# Altium project AioJig.PrjPcb
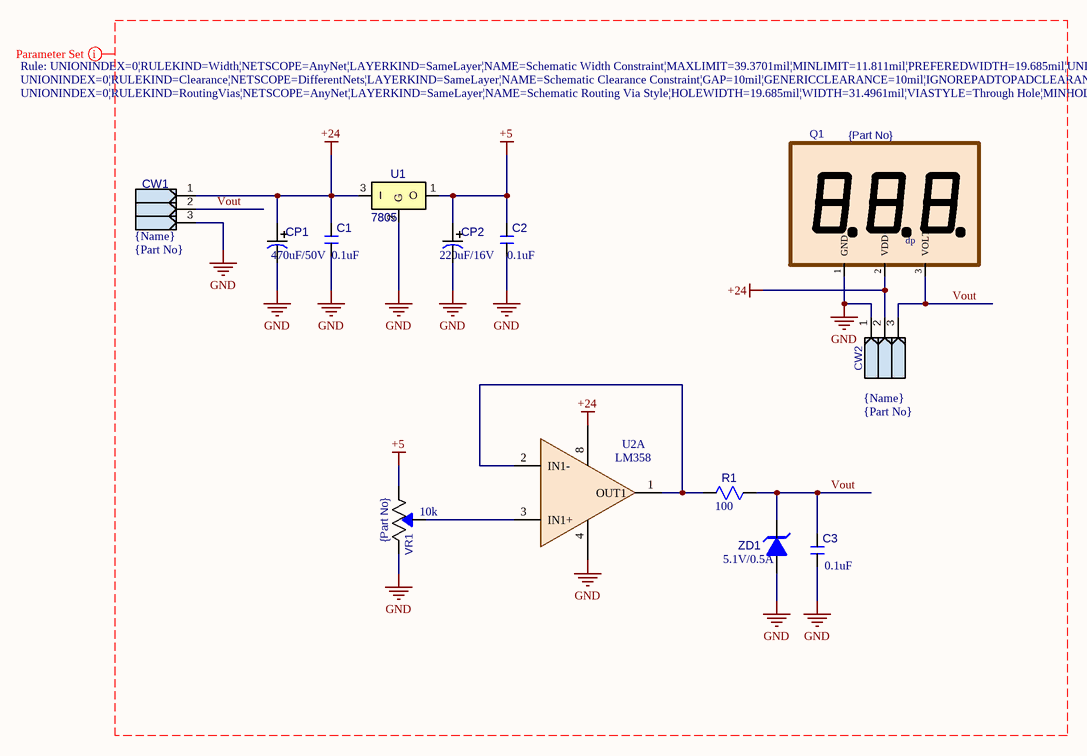
[diagram p0: AiJig.SchDoc]
1 sheet, 13 parts. Net scope: global (net labels, ports and power ports of the same name join across sheets).
Board file: AioJig.PcbDoc

## Sheet AiJig.SchDoc
size A4; SheetNumber: 1; SheetTotal: 1

### Parts
C1  규격: 0.1uF  [CC1608]  (hidden comment: CS0805)
C2  규격: 0.1uF  [CC1608]  (hidden comment: CS0805)
C3  규격: 0.1uF  [CC1608]  (hidden comment: CS0805)
CP1  규격: 470uF/50V  [CP10_SMT]  (hidden comment: CP8_16)
CP2  규격: 220uF/16V  [CP6_SMT]  (hidden comment: CP8_16)
CW1  Name: {Name}  Part No.: {Part No}  [SMW250-03L]  (hidden comment: SMW250-03L)
CW2  Name: {Name}  Part No.: {Part No}  [SMW250-03D]  (hidden comment: SMW250-03D)
Q1  Part No.: {Part No}  [VoltMeter]  (hidden comment: SND-330B)
R1  value 100  [RESC1608X55N]  (hidden comment: CS)
U1  value 7805  [SOT-89]  (hidden comment: 78XX_SOT89)
U2  Part No.: LM358  [SOIC127P600X175-8N]  (hidden comment: NCV2904DR)  (part A of 2)
VR1  value 10k  Part No.: {Part No}  [VR3296]  (hidden comment: VR)
ZD1  value 5.1V/0.5A  [ZD3216M]  (hidden comment: ZD_3216)

### Nets
+5: C2.2 CP2.1 U1.1(O) VR1.1
+24: C1.2 CP1.1 CW1.1 CW2.2 Q1.2(VDD) U1.3(I) U2.8(Vdd)
GND: C1.1 C2.1 C3.1 CP1.2 CP2.2 CW1.3 CW2.1 Q1.1(GND) U1.2(G) U2.4(GND) VR1.3 ZD1.1
Vout: C3.2 CW1.2 CW2.3 Q1.3(VOLT) R1.1 ZD1.2
NetR1_2: R1.2 U2.1(OUT1) U2.2(IN1-)
NetU2_3: U2.3(IN1+) VR1.2

Not connected (* = marked no-connect by the designer): Q1 6; U1 4

### Layout directives
rule Clearance Constraint [Generic clearance = 0.254mm, and 9 value(s) for objects]; rule Width Constraint [Pref Width = 0.5mm    Min Width = 0.3mm    Max Width = 1mm]; rule Routing Via Style [Pref Size = 0.8mm    Pref Hole Size = 0.5mm]: +5, +24, GND, Vout

### Notes on the sheet
- Title
- Size:
- Date:
- A4
- Number:
- Time:
- Revision:
- Sheet
- of
- File:
- (in symbol VoltMeter) dp

### Library data of the parts
C1-C3 = CS_SMT: Part No.: {Part No}; Price: {Price}
CP1 CP2 = CP_SMT: Part No.: {Value}; Price: {Price}
Q1 = VoltMeter: Price: {Price}
R1 = R_SMT: Part No.: {Part No}; Price: {Price}
U1 = 78XX_SOT89: Part No.: LM78L05 KX; Price: 63
U2 = NCD2904: Dual general-purpose operational amplifier; Manufacturer_Name: Texas Instruments; Geometry.Height: 1.75mm; Mouser Part Number: 595-LM2904DR; Mouser Price/Stock: https://www.mouser.co.uk/ProductDetail/Texas-Instruments/LM2904DR?qs=5BZzbFV4k2vkQqOl3Q8qPg%3D%3D; Arrow Part Number: LM2904DR; Arrow Price/Stock: https://www.arrow.com/en/products/lm2904dr/texas-instruments?region=nac; Datasheet Link: http://www.ti.com/lit/gpn/lm2904; Price: {Price}
ZD1 = ZD_3216: 24V/0.5A; Part No.: BZT52C24 / TCMMSZ5252BW; Price: 17
CW1 = SMW250-03L: Price: {Price}
CW2 = SMW250-03D: Price: {Price}
VR1 = VR: Price: {Price}